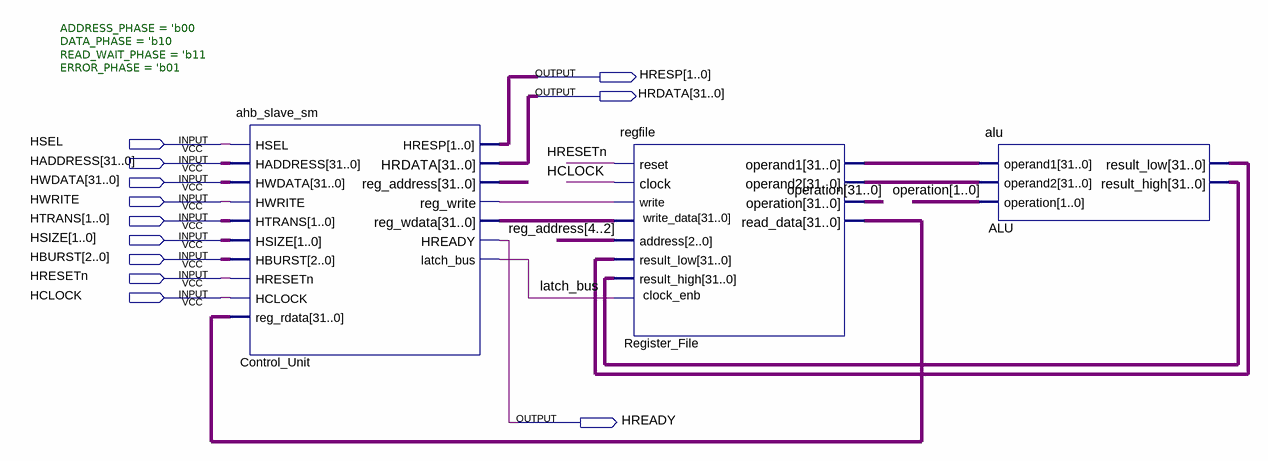
[diagram p0: schematic sheet]
// Quartus schematic pld_slave.bdf as structural Verilog: 3 symbols, 12 pins
module pld_slave (
  input  HSEL,
  input  [31:0] HADDRESS,
  input  [31:0] HWDATA,
  input  HWRITE,
  input  [1:0] HTRANS,
  input  [1:0] HSIZE,
  input  [2:0] HBURST,
  input  HRESETn,
  input  HCLOCK,
  output [1:0] HRESP,
  output [31:0] HRDATA,
  output HREADY
);

  wire Control_Unit_reg_write, latch_bus;
  wire [31:0] ALU_result_high, ALU_result_low, Control_Unit_reg_wdata, operation, reg_address,
       Register_File_operand1, Register_File_operand2, Register_File_read_data;

  ahb_slave_sm #(.ADDRESS_PHASE('b00), .DATA_PHASE('b10), .READ_WAIT_PHASE('b11), .ERROR_PHASE('b01)) Control_Unit (
    .HSEL(HSEL), .HADDRESS(HADDRESS), .HWDATA(HWDATA), .HWRITE(HWRITE), .HTRANS(HTRANS), .HSIZE(HSIZE),
    .HBURST(HBURST), .HRESETn(HRESETn), .HCLOCK(HCLOCK), .reg_rdata(Register_File_read_data), .HRESP(HRESP),
    .HRDATA(HRDATA), .reg_address(reg_address), .reg_write(Control_Unit_reg_write),
    .reg_wdata(Control_Unit_reg_wdata), .HREADY(HREADY), .latch_bus(latch_bus));
  regfile Register_File (
    .reset(HRESETn), .clock(HCLOCK), .write(Control_Unit_reg_write), .clock_enb(latch_bus),
    .address(reg_address[4:2]), .result_low(ALU_result_low), .result_high(ALU_result_high),
    .write_data(Control_Unit_reg_wdata), .operand1(Register_File_operand1),
    .operand2(Register_File_operand2), .read_data(Register_File_read_data), .operation(operation));
  alu ALU (
    .operand1(Register_File_operand1), .operand2(Register_File_operand2), .operation(operation[1:0]),
    .result_low(ALU_result_low), .result_high(ALU_result_high));
endmodule
